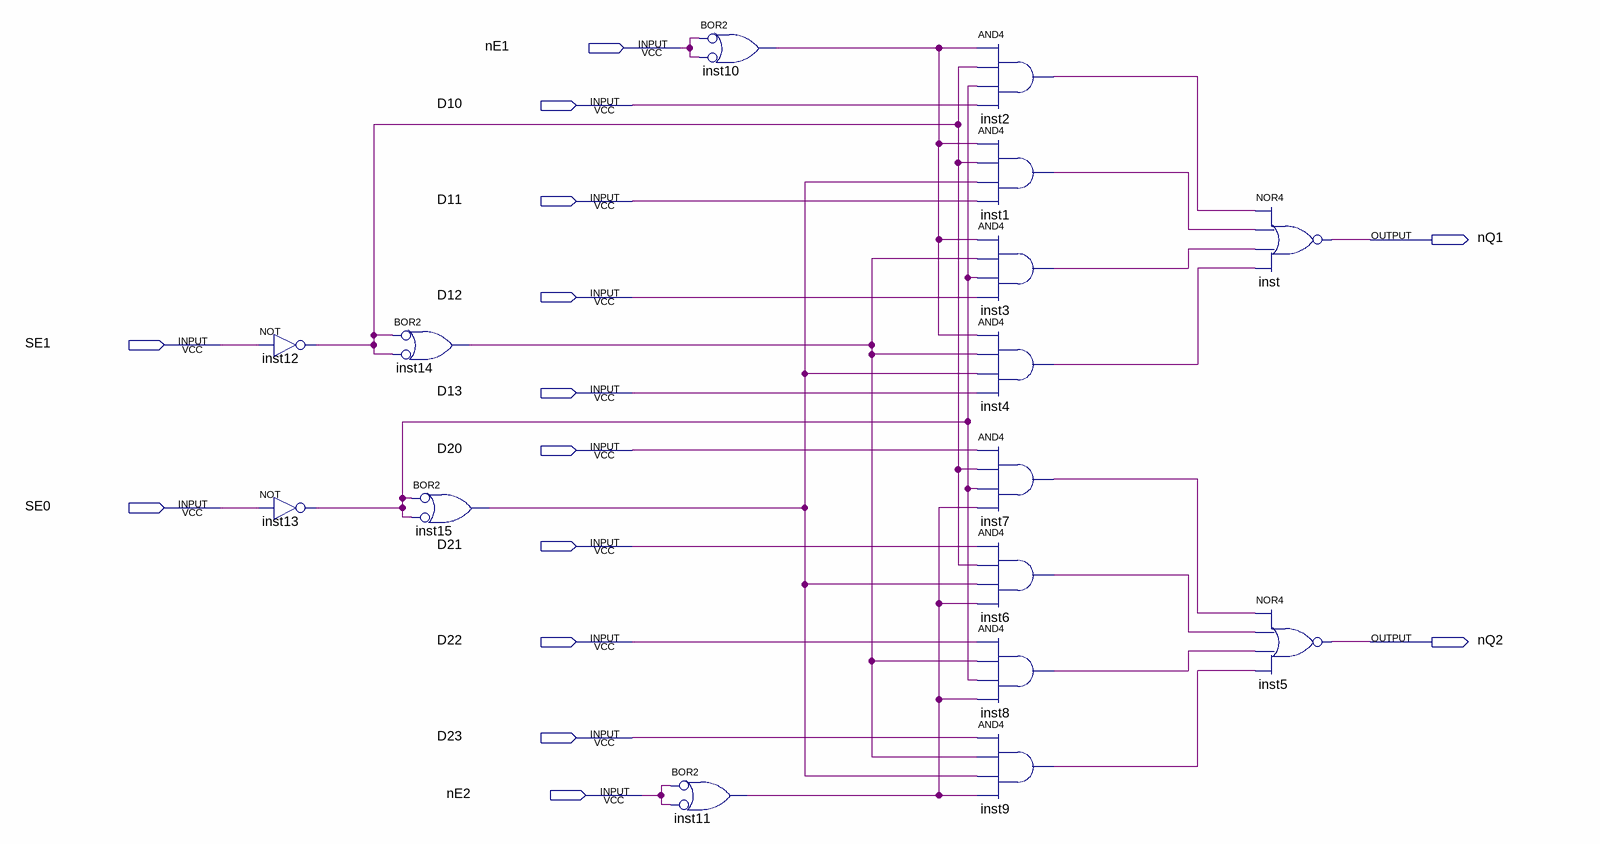
[diagram p0: schematic sheet]
// Quartus schematic kp1533KP19.bdf as structural Verilog: 16 symbols, 14 pins
module kp1533KP19 (
  input  nE1,
  input  D10,
  input  D11,
  input  D12,
  input  SE1,
  input  D13,
  input  D20,
  input  SE0,
  input  D21,
  input  D22,
  input  D23,
  input  nE2,
  output nQ1,
  output nQ2
);

  wire inst1_out, inst2_out, inst3_out, inst4_out, inst6_out, inst7_out, inst8_out, inst9_out, inst10_out,
       inst11_out, inst12_out, inst13_out, inst14_out, inst15_out;

  not inst12 (inst12_out, SE1);
  not inst13 (inst13_out, SE0);
  or inst14 (inst14_out, ~inst12_out, ~inst12_out);  // BOR2
  or inst15 (inst15_out, ~inst13_out, ~inst13_out);  // BOR2
  or inst10 (inst10_out, ~nE1, ~nE1);  // BOR2
  or inst11 (inst11_out, ~nE2, ~nE2);  // BOR2
  and inst2 (inst2_out, inst10_out, inst12_out, inst13_out, D10);
  and inst1 (inst1_out, inst10_out, inst12_out, inst15_out, D11);
  and inst3 (inst3_out, inst10_out, inst14_out, inst13_out, D12);
  and inst4 (inst4_out, inst10_out, inst14_out, inst15_out, D13);
  and inst7 (inst7_out, D20, inst12_out, inst13_out, inst11_out);
  and inst6 (inst6_out, D21, inst12_out, inst15_out, inst11_out);
  and inst8 (inst8_out, D22, inst14_out, inst13_out, inst11_out);
  and inst9 (inst9_out, D23, inst14_out, inst15_out, inst11_out);
  nor inst (nQ1, inst2_out, inst1_out, inst3_out, inst4_out);
  nor inst5 (nQ2, inst7_out, inst6_out, inst8_out, inst9_out);
endmodule
